# Altium schematic sheet P06 CPU_2.SchDoc
size 386 x 246 mm
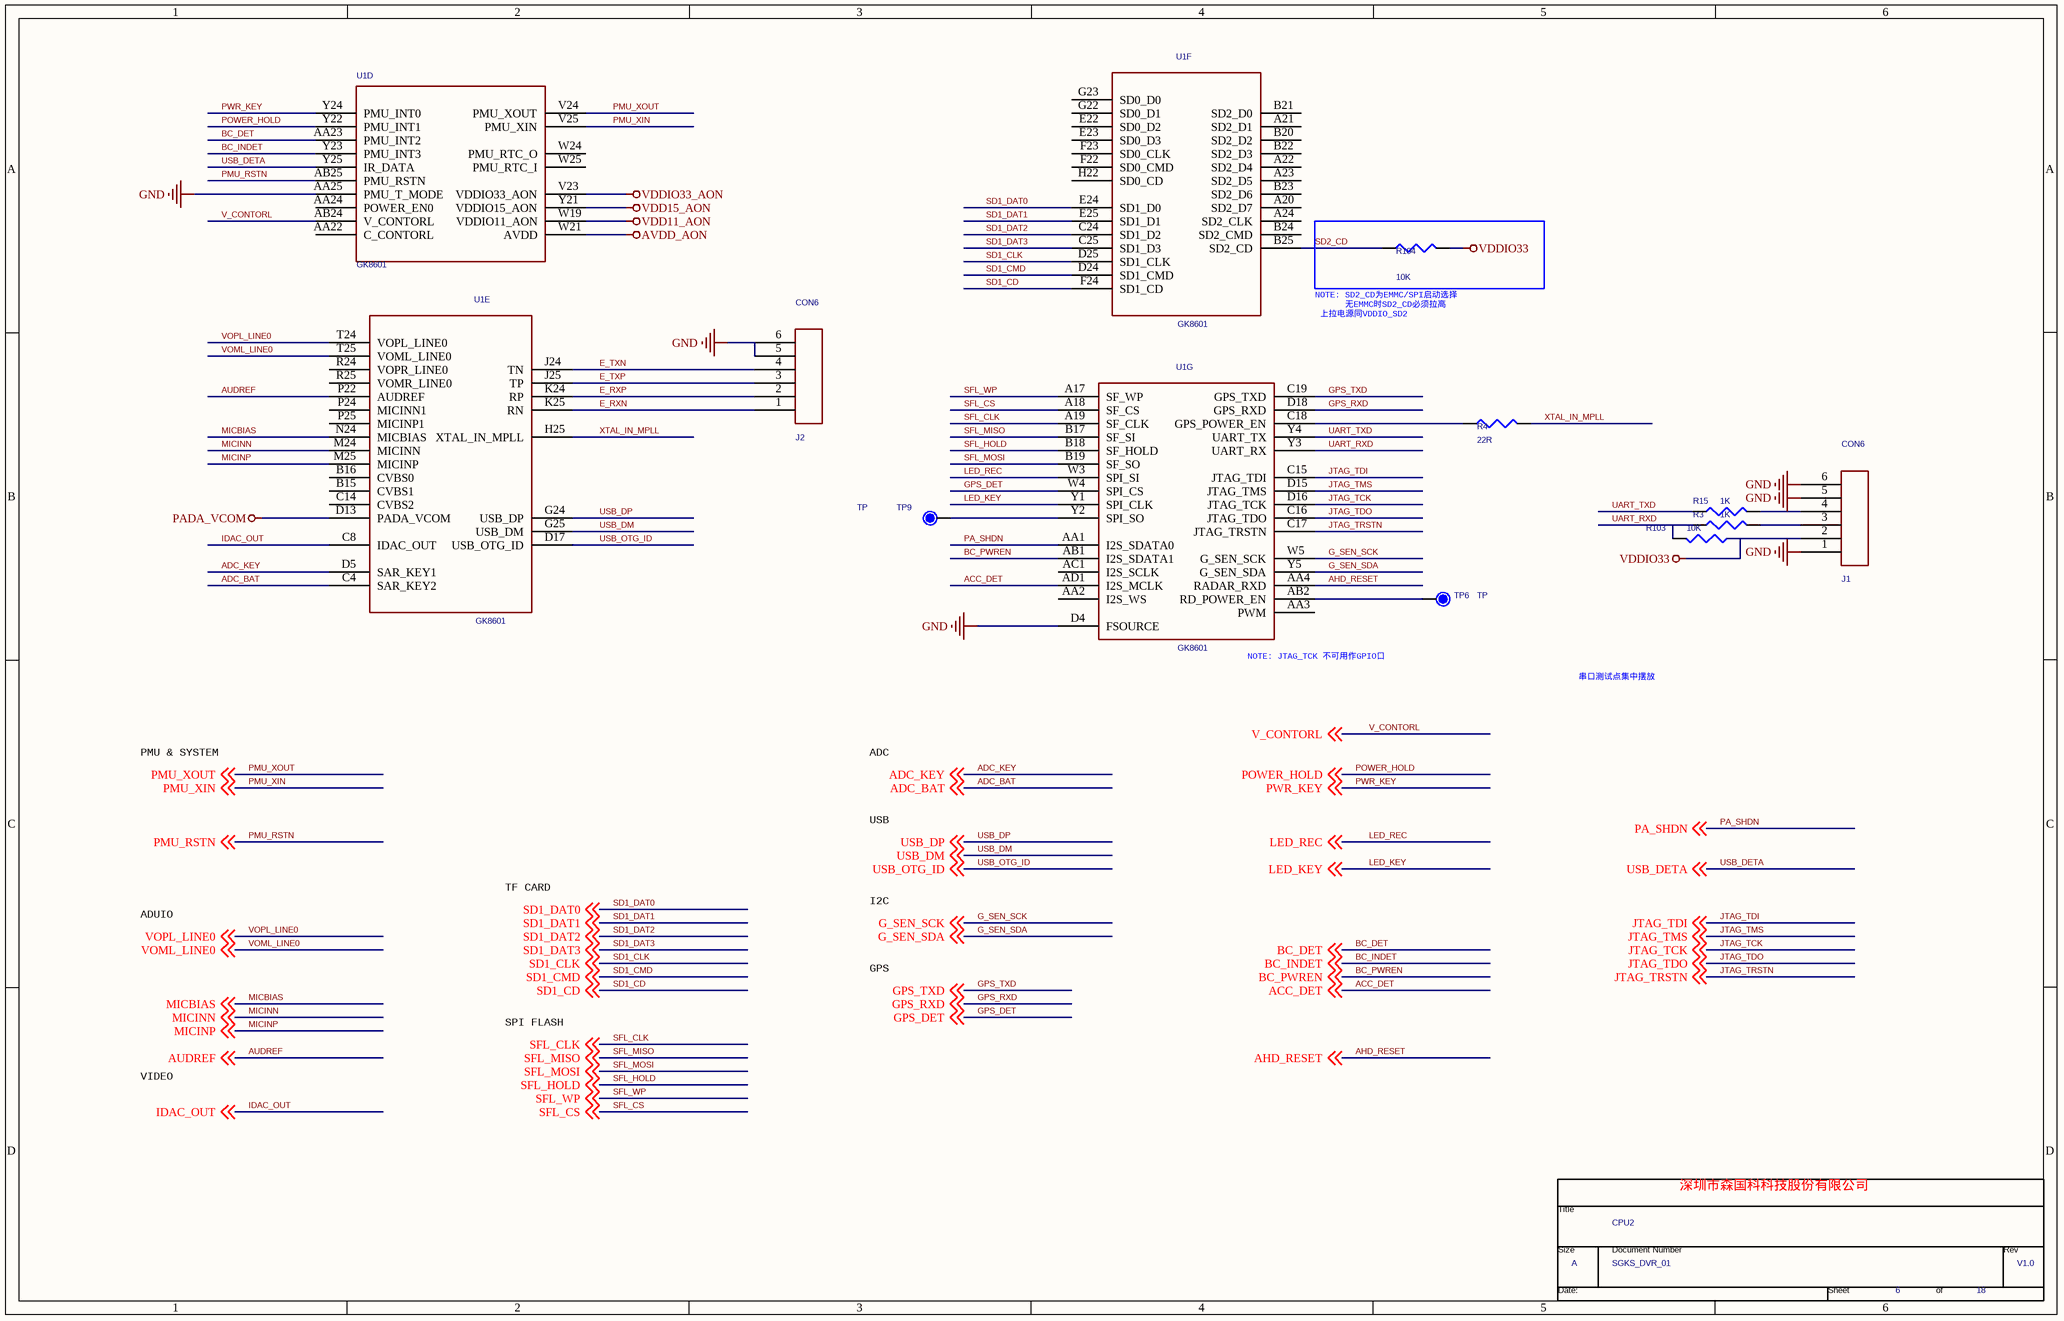
[diagram p0: P06 CPU_2.SchDoc]

## Parts
*  Page Count: 18  Page Number: 6  Page Size: A  Title: CPU2  RevCode: V1.0  Doc: SGKS_DVR_01  (hidden comment: TitleBlock0)  (graphical)
J1  CON6  [SM_125X4_180]
J2  CON6  [SM_125X4_180]
R3  1K  [R0603/SMD]
R4  22R  [R0603/SMD]
R15  1K  [R0603/SMD]
R103  10K  [R0402]
R104  10K  [R0603/SMD]
TP6  TP  [TP/SMD/D1.0]
TP9  TP  [TP/SMD/D1.0]
U1  GK8601  [FBGA-569-0.65-17X17]  (parts D,E,F,G of 12)

## Nets
AVDD_AON: U1.W21(AVDD)
GND: J1.1 J1.5 J1.6 J2.5 J2.6 U1.AA25(PMU_T_MODE) U1.D4(FSOURCE)
PADA_VCOM: U1.D13(PADA_VCOM)
VDD11_AON: U1.W19(VDDIO11_AON)
VDD15_AON: U1.Y21(VDDIO15_AON)
VDDIO33: J1.2 R103.1 R104.1
VDDIO33_AON: U1.V23(VDDIO33_AON)
ACC_DET: U1.AD1(I2S_MCLK) ; off-sheet ACC_DET
ADC_BAT: U1.C4(SAR_KEY2) ; off-sheet ADC_BAT
ADC_KEY: U1.D5(SAR_KEY1) ; off-sheet ADC_KEY
AHD_RESET: U1.AA4(RADAR_RXD) ; off-sheet AHD_RESET
AUDREF: U1.P22(AUDREF) ; off-sheet AUDREF
BC_DET: U1.AA23(PMU_INT2) ; off-sheet BC_DET
BC_INDET: U1.Y23(PMU_INT3) ; off-sheet BC_INDET
BC_PWREN: U1.AB1(I2S_SDATA1) ; off-sheet BC_PWREN
E_RXN: J2.1 U1.K25(RN)
E_RXP: J2.2 U1.K24(RP)
E_TXN: J2.4 U1.J24(TN)
E_TXP: J2.3 U1.J25(TP)
G_SEN_SCK: U1.W5(G_SEN_SCK) ; off-sheet G_SEN_SCK
G_SEN_SDA: U1.Y5(G_SEN_SDA) ; off-sheet G_SEN_SDA
GPS_DET: U1.W4(SPI_CS) ; off-sheet GPS_DET
GPS_RXD: U1.D18(GPS_RXD) ; off-sheet GPS_RXD
GPS_TXD: U1.C19(GPS_TXD) ; off-sheet GPS_TXD
IDAC_OUT: U1.C8(IDAC_OUT) ; off-sheet IDAC_OUT
JTAG_TCK: U1.D16(JTAG_TCK) ; off-sheet JTAG_TCK
JTAG_TDI: U1.C15(JTAG_TDI) ; off-sheet JTAG_TDI
JTAG_TDO: U1.C16(JTAG_TDO) ; off-sheet JTAG_TDO
JTAG_TMS: U1.D15(JTAG_TMS) ; off-sheet JTAG_TMS
JTAG_TRSTN: U1.C17(JTAG_TRSTN) ; off-sheet JTAG_TRSTN
LED_KEY: U1.Y1(SPI_CLK) ; off-sheet LED_KEY
LED_REC: U1.W3(SPI_SI) ; off-sheet LED_REC
MICBIAS: U1.N24(MICBIAS) ; off-sheet MICBIAS
MICINN: U1.M24(MICINN) ; off-sheet MICINN
MICINP: U1.M25(MICINP) ; off-sheet MICINP
PA_SHDN: U1.AA1(I2S_SDATA0) ; off-sheet PA_SHDN
PMU_RSTN: U1.AB25(PMU_RSTN) ; off-sheet PMU_RSTN
PMU_XIN: U1.V25(PMU_XIN) ; off-sheet PMU_XIN
PMU_XOUT: U1.V24(PMU_XOUT) ; off-sheet PMU_XOUT
POWER_HOLD: U1.Y22(PMU_INT1) ; off-sheet POWER_HOLD
PWR_KEY: U1.Y24(PMU_INT0) ; off-sheet PWR_KEY
SD1_CD: U1.F24(SD1_CD) ; off-sheet SD1_CD
SD1_CLK: U1.D25(SD1_CLK) ; off-sheet SD1_CLK
SD1_CMD: U1.D24(SD1_CMD) ; off-sheet SD1_CMD
SD1_DAT0: U1.E24(SD1_D0) ; off-sheet SD1_DAT0
SD1_DAT1: U1.E25(SD1_D1) ; off-sheet SD1_DAT1
SD1_DAT2: U1.C24(SD1_D2) ; off-sheet SD1_DAT2
SD1_DAT3: U1.C25(SD1_D3) ; off-sheet SD1_DAT3
SD2_CD: R104.2 U1.B25(SD2_CD)
SFL_CLK: U1.A19(SF_CLK) ; off-sheet SFL_CLK
SFL_CS: U1.A18(SF_CS) ; off-sheet SFL_CS
SFL_HOLD: U1.B18(SF_HOLD) ; off-sheet SFL_HOLD
SFL_MISO: U1.B17(SF_SI) ; off-sheet SFL_MISO
SFL_MOSI: U1.B19(SF_SO) ; off-sheet SFL_MOSI
SFL_WP: U1.A17(SF_WP) ; off-sheet SFL_WP
UART_RXD: R3.1 R103.2 U1.Y3(UART_RX)
UART_TXD: R15.1 U1.Y4(UART_TX)
USB_DETA: U1.Y25(IR_DATA) ; off-sheet USB_DETA
USB_DM: U1.G25(USB_DM) ; off-sheet USB_DM
USB_DP: U1.G24(USB_DP) ; off-sheet USB_DP
USB_OTG_ID: U1.D17(USB_OTG_ID) ; off-sheet USB_OTG_ID
V_CONTORL: U1.AB24(V_CONTORL) ; off-sheet V_CONTORL
VOML_LINE0: U1.T25(VOML_LINE0) ; off-sheet VOML_LINE0
VOPL_LINE0: U1.T24(VOPL_LINE0) ; off-sheet VOPL_LINE0
XTAL_IN_MPLL: R4.2 U1.H25(XTAL_IN_MPLL)
NetJ1_3: J1.3 R3.2
NetJ1_4: J1.4 R15.2
NetR4_1: R4.1 U1.C18(GPS_POWER_EN)
NetTP6_1: TP6.1 U1.AB2(RD_POWER_EN)
NetTP9_1: TP9.1 U1.Y2(SPI_SO)

Not connected (* = marked no-connect by the designer): U1 A20(SD2_D7) A21(SD2_D1) A22(SD2_D4) A23(SD2_D5) A24(SD2_CLK) AA2(I2S_WS) AA3(PWM) AA22(C_CONTORL) AA24(POWER_EN0) AC1(I2S_SCLK) B15(CVBS1) B16(CVBS0) B20(SD2_D2) B21(SD2_D0) B22(SD2_D3) B23(SD2_D6) B24(SD2_CMD) C14(CVBS2) E22(SD0_D2) E23(SD0_D3) F22(SD0_CMD) F23(SD0_CLK) G22(SD0_D1) G23(SD0_D0) H22(SD0_CD) P24(MICINN1) P25(MICINP1) R24(VOPR_LINE0) R25(VOMR_LINE0) W24(PMU_RTC_O) W25(PMU_RTC_I)

## Notes on the sheet
- NOTE: SD2_CD为EMMC/SPI启动选择
  无EMMC时SD2_CD必须拉高
  上拉电源同VDDIO_SD2
- (near U1) NOTE: JTAG_TCK 不可用作GPIO口
- 串口测试点集中摆放
- PMU & SYSTEM
- ADC
- USB
- ADUIO
- TF CARD
- I2C
- GPS
- SPI FLASH
- VIDEO
- 深圳市森国科科技股份有限公司
- (in symbol TitleBlock0) Title; Size; Document Number; Rev; Date:; Sheet; of

## Library data of the parts
R3 R4 R15 R104 = RES/SMD_0: Part Description: Chip Resistor; Type: 贴片电阻
R103 = RESISTOR_Dup1: RES - 200 ohm 0603 1/16W 1%; Num Pins: 2; Page: 5
TP6 TP9 = TP_0: Part Description: Test Point; Type: NC
U1 = GK8601_12
* = TitleBlock0: Page Create Date: March  8, 1995